# Altium schematic sheet 01)CPU-1.SchDoc
size 297 x 209 mm
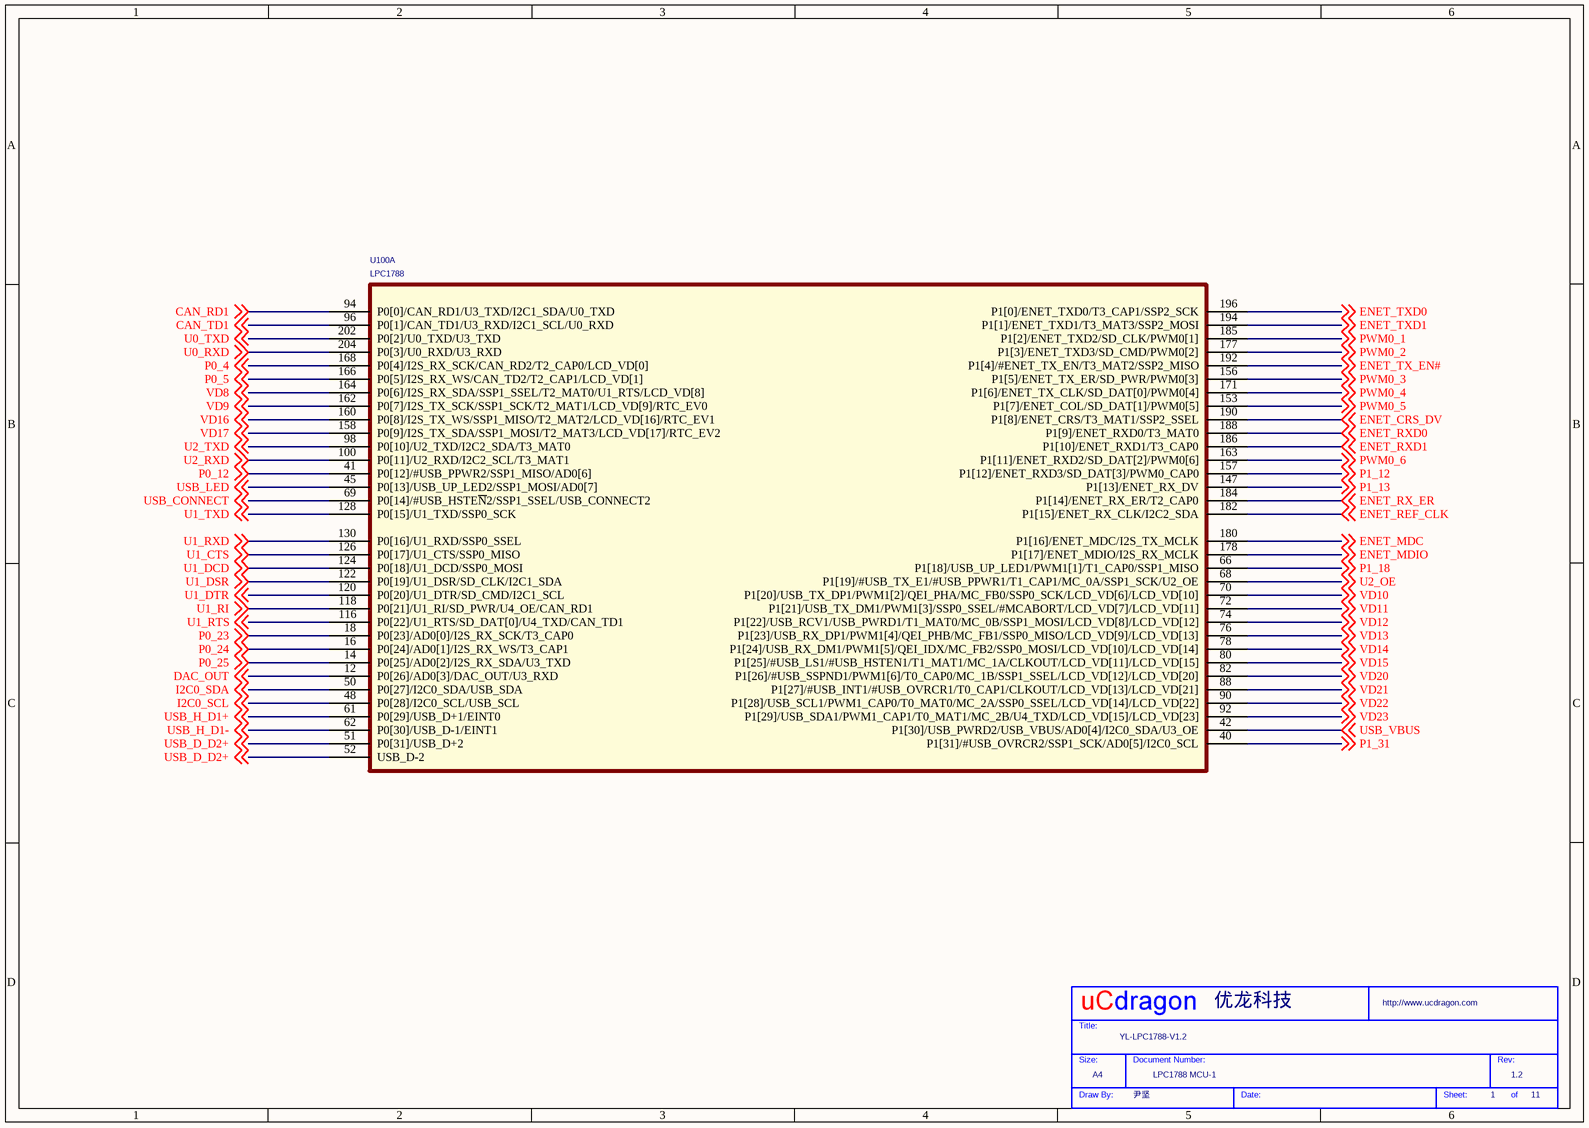
[diagram p0: 01)CPU-1.SchDoc]

## Parts
*  Page Count: 11  Page Number: 1  Page Size: A4  Title: YL-LPC1788-V1.2  RevCode: 1.2  Doc: LPC1788 MCU-1  Drawing: 尹坚  Company: 优龙科技  (hidden comment: My Title 0)  (graphical)
U100  LPC1788  [LQFP208_28X28X05P]  (part A of 3)

## Nets
CAN_RD1: U100.94(P0[0]/CAN_RD1/U3_TXD/I2C1_SDA/U0_TXD) ; off-sheet CAN_RD1
CAN_TD1: U100.96(P0[1]/CAN_TD1/U3_RXD/I2C1_SCL/U0_RXD) ; off-sheet CAN_TD1
DAC_OUT: U100.12(P0[26]/AD0[3]/DAC_OUT/U3_RXD) ; off-sheet DAC_OUT
ENET_CRS_DV: U100.190(P1[8]/ENET_CRS/T3_MAT1/SSP2_SSEL) ; off-sheet ENET_CRS_DV
ENET_MDC: U100.180(P1[16]/ENET_MDC/I2S_TX_MCLK) ; off-sheet ENET_MDC
ENET_MDIO: U100.178(P1[17]/ENET_MDIO/I2S_RX_MCLK) ; off-sheet ENET_MDIO
ENET_REF_CLK: U100.182(P1[15]/ENET_RX_CLK/I2C2_SDA) ; off-sheet ENET_REF_CLK
ENET_RX_ER: U100.184(P1[14]/ENET_RX_ER/T2_CAP0) ; off-sheet ENET_RX_ER
ENET_RXD0: U100.188(P1[9]/ENET_RXD0/T3_MAT0) ; off-sheet ENET_RXD0
ENET_RXD1: U100.186(P1[10]/ENET_RXD1/T3_CAP0) ; off-sheet ENET_RXD1
ENET_TX_EN#: U100.192(P1[4]/#ENET_TX_EN/T3_MAT2/SSP2_MISO) ; off-sheet ENET_TX_EN#
ENET_TXD0: U100.196(P1[0]/ENET_TXD0/T3_CAP1/SSP2_SCK) ; off-sheet ENET_TXD0
ENET_TXD1: U100.194(P1[1]/ENET_TXD1/T3_MAT3/SSP2_MOSI) ; off-sheet ENET_TXD1
I2C0_SCL: U100.48(P0[28]/I2C0_SCL/USB_SCL) ; off-sheet I2C0_SCL
I2C0_SDA: U100.50(P0[27]/I2C0_SDA/USB_SDA) ; off-sheet I2C0_SDA
P0_4: U100.168(P0[4]/I2S_RX_SCK/CAN_RD2/T2_CAP0/LCD_VD[0]) ; off-sheet P0_4
P0_5: U100.166(P0[5]/I2S_RX_WS/CAN_TD2/T2_CAP1/LCD_VD[1]) ; off-sheet P0_5
P0_12: U100.41(P0[12]/#USB_PPWR2/SSP1_MISO/AD0[6]) ; off-sheet P0_12
P0_23: U100.18(P0[23]/AD0[0]/I2S_RX_SCK/T3_CAP0) ; off-sheet P0_23
P0_24: U100.16(P0[24]/AD0[1]/I2S_RX_WS/T3_CAP1) ; off-sheet P0_24
P0_25: U100.14(P0[25]/AD0[2]/I2S_RX_SDA/U3_TXD) ; off-sheet P0_25
P1_12: U100.157(P1[12]/ENET_RXD3/SD_DAT[3]/PWM0_CAP0) ; off-sheet P1_12
P1_13: U100.147(P1[13]/ENET_RX_DV) ; off-sheet P1_13
P1_18: U100.66(P1[18]/USB_UP_LED1/PWM1[1]/T1_CAP0/SSP1_MISO) ; off-sheet P1_18
P1_31: U100.40(P1[31]/#USB_OVRCR2/SSP1_SCK/AD0[5]/I2C0_SCL) ; off-sheet P1_31
PWM0_1: U100.185(P1[2]/ENET_TXD2/SD_CLK/PWM0[1]) ; off-sheet PWM0_1
PWM0_2: U100.177(P1[3]/ENET_TXD3/SD_CMD/PWM0[2]) ; off-sheet PWM0_2
PWM0_3: U100.156(P1[5]/ENET_TX_ER/SD_PWR/PWM0[3]) ; off-sheet PWM0_3
PWM0_4: U100.171(P1[6]/ENET_TX_CLK/SD_DAT[0]/PWM0[4]) ; off-sheet PWM0_4
PWM0_5: U100.153(P1[7]/ENET_COL/SD_DAT[1]/PWM0[5]) ; off-sheet PWM0_5
PWM0_6: U100.163(P1[11]/ENET_RXD2/SD_DAT[2]/PWM0[6]) ; off-sheet PWM0_6
U0_RXD: U100.204(P0[3]/U0_RXD/U3_RXD) ; off-sheet U0_RXD
U0_TXD: U100.202(P0[2]/U0_TXD/U3_TXD) ; off-sheet U0_TXD
U1_CTS: U100.126(P0[17]/U1_CTS/SSP0_MISO) ; off-sheet U1_CTS
U1_DCD: U100.124(P0[18]/U1_DCD/SSP0_MOSI) ; off-sheet U1_DCD
U1_DSR: U100.122(P0[19]/U1_DSR/SD_CLK/I2C1_SDA) ; off-sheet U1_DSR
U1_DTR: U100.120(P0[20]/U1_DTR/SD_CMD/I2C1_SCL) ; off-sheet U1_DTR
U1_RI: U100.118(P0[21]/U1_RI/SD_PWR/U4_OE/CAN_RD1) ; off-sheet U1_RI
U1_RTS: U100.116(P0[22]/U1_RTS/SD_DAT[0]/U4_TXD/CAN_TD1) ; off-sheet U1_RTS
U1_RXD: U100.130(P0[16]/U1_RXD/SSP0_SSEL) ; off-sheet U1_RXD
U1_TXD: U100.128(P0[15]/U1_TXD/SSP0_SCK) ; off-sheet U1_TXD
U2_OE: U100.68(P1[19]/#USB_TX_E1/#USB_PPWR1/T1_CAP1/MC_0A/SSP1_SCK/U2_OE) ; off-sheet U2_OE
U2_RXD: U100.100(P0[11]/U2_RXD/I2C2_SCL/T3_MAT1) ; off-sheet U2_RXD
U2_TXD: U100.98(P0[10]/U2_TXD/I2C2_SDA/T3_MAT0) ; off-sheet U2_TXD
USB_CONNECT: U100.69(P0[14]/#USB_HSTE~{N}2/SSP1_SSEL/USB_CONNECT2) ; off-sheet USB_CONNECT
USB_D_D2+: U100.51(P0[31]/USB_D+2) U100.52(USB_D-2) ; off-sheet USB_D_D2+
USB_H_D1+: U100.61(P0[29]/USB_D+1/EINT0) ; off-sheet USB_H_D1+
USB_H_D1-: U100.62(P0[30]/USB_D-1/EINT1) ; off-sheet USB_H_D1-
USB_LED: U100.45(P0[13]/USB_UP_LED2/SSP1_MOSI/AD0[7]) ; off-sheet USB_LED
USB_VBUS: U100.42(P1[30]/USB_PWRD2/USB_VBUS/AD0[4]/I2C0_SDA/U3_OE) ; off-sheet USB_VBUS
VD8: U100.164(P0[6]/I2S_RX_SDA/SSP1_SSEL/T2_MAT0/U1_RTS/LCD_VD[8]) ; off-sheet VD8
VD9: U100.162(P0[7]/I2S_TX_SCK/SSP1_SCK/T2_MAT1/LCD_VD[9]/RTC_EV0) ; off-sheet VD9
VD10: U100.70(P1[20]/USB_TX_DP1/PWM1[2]/QEI_PHA/MC_FB0/SSP0_SCK/LCD_VD[6]/LCD_VD[10]) ; off-sheet VD10
VD11: U100.72(P1[21]/USB_TX_DM1/PWM1[3]/SSP0_SSEL/#MCABORT/LCD_VD[7]/LCD_VD[11]) ; off-sheet VD11
VD12: U100.74(P1[22]/USB_RCV1/USB_PWRD1/T1_MAT0/MC_0B/SSP1_MOSI/LCD_VD[8]/LCD_VD[12]) ; off-sheet VD12
VD13: U100.76(P1[23]/USB_RX_DP1/PWM1[4]/QEI_PHB/MC_FB1/SSP0_MISO/LCD_VD[9]/LCD_VD[13]) ; off-sheet VD13
VD14: U100.78(P1[24]/USB_RX_DM1/PWM1[5]/QEI_IDX/MC_FB2/SSP0_MOSI/LCD_VD[10]/LCD_VD[14]) ; off-sheet VD14
VD15: U100.80(P1[25]/#USB_LS1/#USB_HSTEN1/T1_MAT1/MC_1A/CLKOUT/LCD_VD[11]/LCD_VD[15]) ; off-sheet VD15
VD16: U100.160(P0[8]/I2S_TX_WS/SSP1_MISO/T2_MAT2/LCD_VD[16]/RTC_EV1) ; off-sheet VD16
VD17: U100.158(P0[9]/I2S_TX_SDA/SSP1_MOSI/T2_MAT3/LCD_VD[17]/RTC_EV2) ; off-sheet VD17
VD20: U100.82(P1[26]/#USB_SSPND1/PWM1[6]/T0_CAP0/MC_1B/SSP1_SSEL/LCD_VD[12]/LCD_VD[20]) ; off-sheet VD20
VD21: U100.88(P1[27]/#USB_INT1/#USB_OVRCR1/T0_CAP1/CLKOUT/LCD_VD[13]/LCD_VD[21]) ; off-sheet VD21
VD22: U100.90(P1[28]/USB_SCL1/PWM1_CAP0/T0_MAT0/MC_2A/SSP0_SSEL/LCD_VD[14]/LCD_VD[22]) ; off-sheet VD22
VD23: U100.92(P1[29]/USB_SDA1/PWM1_CAP1/T0_MAT1/MC_2B/U4_TXD/LCD_VD[15]/LCD_VD[23]) ; off-sheet VD23

## Notes on the sheet
- (in symbol My Title 0) Title:; Size:; Document Number:; Rev:; Draw By:; Date:; Sheet:; of

## Library data of the parts
* = My Title 0: Page Create Date: May 29, 2006; WebSite: http://www.ucdragon.com